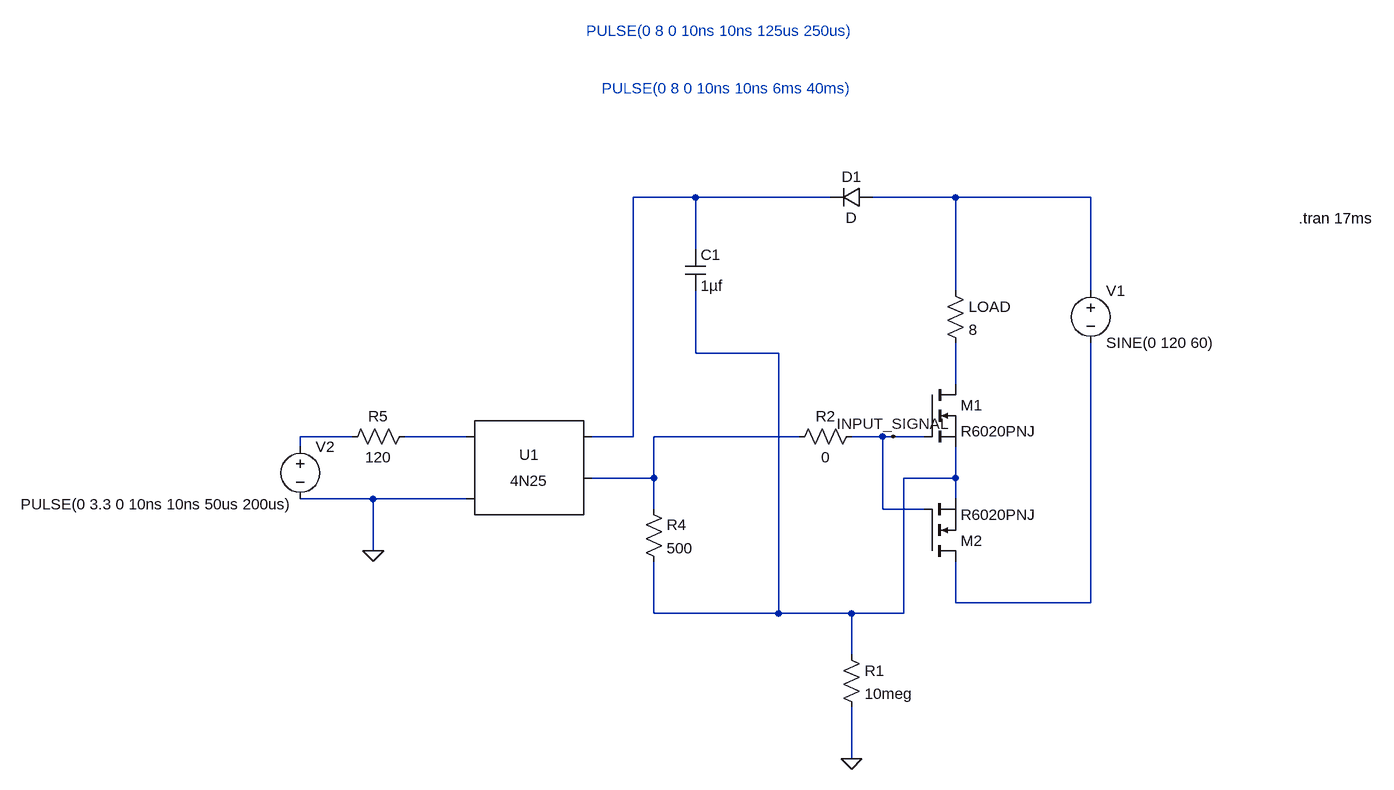
[diagram p0: schematic AC_FET_DRIVER.asc]
AC_FET_DRIVER.asc, the LTspice schematic file:
Version 4
SHEET 1 1000 868
WIRE -80 -16 -176 -16
WIRE 128 -16 -80 -16
WIRE 320 -16 192 -16
WIRE 528 -16 320 -16
WIRE -80 64 -80 -16
WIRE 320 128 320 -16
WIRE 528 128 528 -16
WIRE -80 224 -80 128
WIRE 48 224 -80 224
WIRE 320 272 320 208
WIRE -608 352 -688 352
WIRE -432 352 -528 352
WIRE -176 352 -176 -16
WIRE -176 352 -240 352
WIRE 80 352 -144 352
WIRE 208 352 160 352
WIRE 224 352 208 352
WIRE 272 352 224 352
WIRE -688 368 -688 352
WIRE -144 416 -144 352
WIRE -144 416 -240 416
WIRE 320 416 320 368
WIRE 320 416 240 416
WIRE -576 448 -688 448
WIRE -432 448 -576 448
WIRE 320 448 320 416
WIRE -144 464 -144 416
WIRE 208 464 208 352
WIRE 272 464 208 464
WIRE -576 528 -576 448
WIRE 320 608 320 544
WIRE 528 608 528 208
WIRE 528 608 320 608
WIRE -144 624 -144 544
WIRE 48 624 48 224
WIRE 48 624 -144 624
WIRE 160 624 48 624
WIRE 240 624 240 416
WIRE 240 624 160 624
WIRE 160 688 160 624
WIRE 160 848 160 768
FLAG 160 848 0
FLAG 224 352 INPUT_SIGNAL
FLAG -576 528 0
SYMBOL voltage 528 112 R0
WINDOW 123 0 0 Left 2
WINDOW 39 0 0 Left 2
SYMATTR InstName V1
SYMATTR Value SINE(0 120 60)
SYMBOL res 304 112 R0
SYMATTR InstName LOAD
SYMATTR Value 8
SYMBOL nmos 272 272 R0
SYMATTR InstName M1
SYMATTR Value R6020PNJ
SYMBOL res 64 368 R270
WINDOW 0 32 56 VTop 2
WINDOW 3 0 56 VBottom 2
SYMATTR InstName R2
SYMATTR Value 0
SYMBOL nmos 272 544 M180
SYMATTR InstName M2
SYMATTR Value R6020PNJ
SYMBOL diode 192 -32 R90
WINDOW 0 0 32 VBottom 2
WINDOW 3 32 32 VTop 2
SYMATTR InstName D1
SYMBOL cap -96 64 R0
SYMATTR InstName C1
SYMATTR Value 1µf
SYMBOL res -160 448 R0
SYMATTR InstName R4
SYMATTR Value 500
SYMBOL Optos\\4N25 -336 416 R0
SYMATTR InstName U1
SYMBOL voltage -688 352 R0
WINDOW 123 0 0 Left 2
WINDOW 39 0 0 Left 2
WINDOW 3 -430 104 Left 2
SYMATTR InstName V2
SYMATTR Value PULSE(0 3.3 0 10ns 10ns 50us 200us)
SYMBOL res -512 336 R90
WINDOW 0 0 56 VBottom 2
WINDOW 3 32 56 VTop 2
SYMATTR InstName R5
SYMATTR Value 120
SYMBOL res 144 672 R0
SYMATTR InstName R1
SYMATTR Value 10meg
TEXT 848 16 Left 2 !.tran 17ms
TEXT -248 -272 Left 2 ;PULSE(0 8 0 10ns 10ns 125us 250us)
TEXT -224 -184 Left 2 ;PULSE(0 8 0 10ns 10ns 6ms 40ms)

The netlist it stands for:
* AC_FET_DRIVER.asc
V1 N002 N008 SINE(0 120 60)
R§LOAD N002 N004 8
M1 N004 INPUT_SIGNAL N003 N003 R6020PNJ
R2 N007 INPUT_SIGNAL 0
M2 N008 INPUT_SIGNAL N003 N003 R6020PNJ
D1 N002 N001 D
C1 N001 N003 1µf
R4 N007 N003 500
XU1 N006 0 N001 N007 NC_01 4N25
V2 N005 0 PULSE(0 3.3 0 10ns 10ns 50us 200us)
R5 N006 N005 120
R1 N003 0 10meg
.model D D
.lib standard.dio
.model NMOS NMOS
.model PMOS PMOS
.lib standard.mos
.tran 17ms
* PULSE(0 8 0 10ns 10ns 125us 250us)
* PULSE(0 8 0 10ns 10ns 6ms 40ms)
.lib 4N25.sub
.backanno
.end